# Altium schematic sheet LORA.SchDoc
size A4
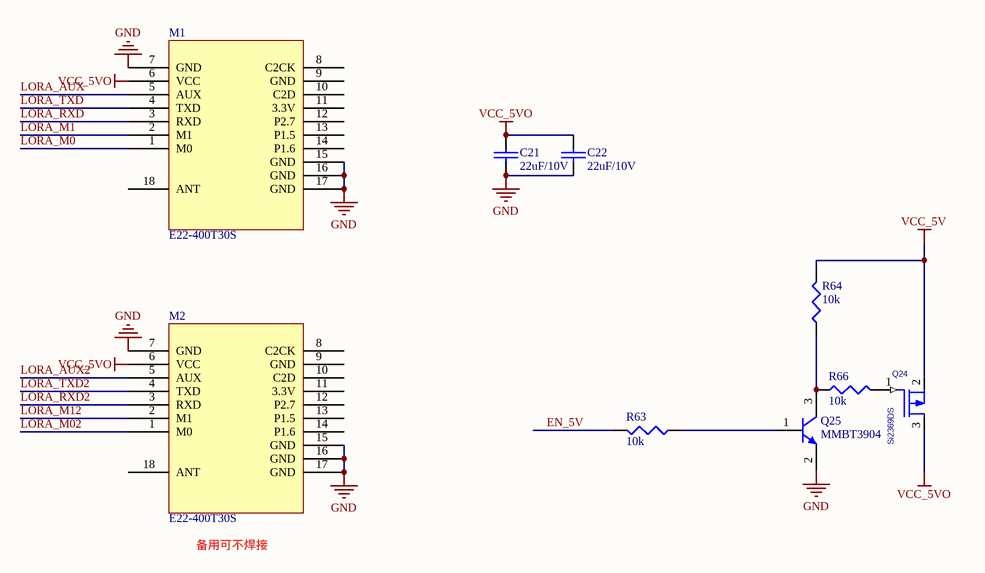
[diagram p0: LORA.SchDoc]

## Parts
C21  22uF/10V  [1206C]
C22  22uF/10V  [1206C]
M1  E22-400T30S  [E22-400T30S]
M2  E22-400T30S  [E22-400T30S]
Q24  Si2369DS  [SOT23]
Q25  MMBT3904  [SOT23-3]
R63  10k  [0603R]
R64  10k  [0603R]
R66  10k  [0603R]

## Nets
GND: C21.2 C22.2 M1.7(GND) M1.15(GND) M1.16(GND) M1.17(GND) M2.7(GND) M2.15(GND) M2.16(GND) M2.17(GND) Q25.2(E)
VCC_5V: Q24.2(DRAIN) R64.2
VCC_5VO: C21.1 C22.1 M1.6(VCC) M2.6(VCC) Q24.3(SOURCE)
EN_5V: R63.2
LORA_AUX: M1.5(AUX)
LORA_AUX2: M2.5(AUX)
LORA_M0: M1.1(M0)
LORA_M1: M1.2(M1)
LORA_M02: M2.1(M0)
LORA_M12: M2.2(M1)
LORA_RXD: M1.3(RXD)
LORA_RXD2: M2.3(RXD)
LORA_TXD: M1.4(TXD)
LORA_TXD2: M2.4(TXD)
NetQ24_1: Q24.1(GATE) R66.2
NetQ25_1: Q25.1(B) R63.1
NetQ25_3: Q25.3(C) R64.1 R66.1

Not connected (* = marked no-connect by the designer): M1 8(C2CK) 9(GND) 10(C2D) 11(3.3V) 12(P2.7) 13(P1.5) 14(P1.6) 18(ANT); M2 8(C2CK) 9(GND) 10(C2D) 11(3.3V) 12(P2.7) 13(P1.5) 14(P1.6) 18(ANT)

## Notes on the sheet
- 备用可不焊接

## Library data of the parts
C21 C22 = CAP: Capacitor
Q24 = MOSFET P_1: Color: RGB(255,  0,  0)
Q25 = NPN
R63 R64 R66 = RES1: P: 1/8W